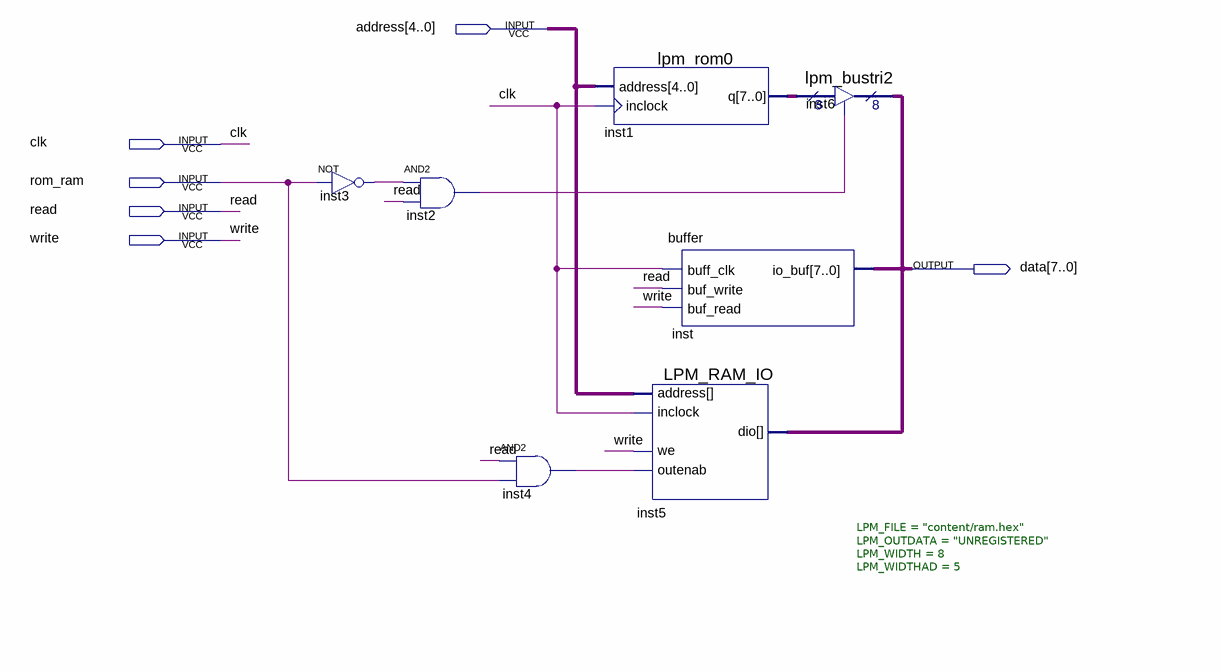
[diagram p0: schematic sheet]
// Quartus schematic main.bdf as structural Verilog: 7 symbols, 6 pins
module main (
  input  [4:0] address,
  input  clk,
  input  rom_ram,
  input  read,
  input  write,
  output [7:0] data
);

  wire inst2_out, inst3_out, inst4_out;
  wire [7:0] inst1_q;

  not inst3 (inst3_out, rom_ram);
  and inst2 (inst2_out, inst3_out, read);
  and inst4 (inst4_out, read, rom_ram);
  lpm_rom0 inst1 (.address(address), .inclock(clk), .q(inst1_q));
  LPM_RAM_IO #(.LPM_FILE("content/ram.hex"), .LPM_OUTDATA("UNREGISTERED"), .LPM_WIDTH(8), .LPM_WIDTHAD(5)) inst5 (
    .address(address), .inclock(clk), .we(write), .outenab(inst4_out), .dio(data));
  buffer inst (.buff_clk(clk), .buf_write(read), .buf_read(write), .io_buf(data));
  lpm_bustri2 inst6 (.enabledt(inst2_out), .data(inst1_q), .tridata(data));
endmodule
